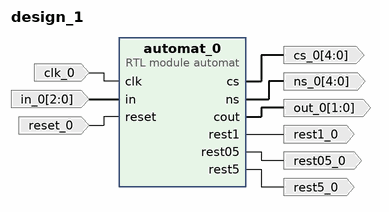
[diagram p0: block diagram of the top level]
# Vivado block design design_1, xc7a100tcsg324-1, Vivado 2020.2
create_bd_design design_1

create_bd_port -dir I -type clk clk_0
create_bd_port -dir O -from 4 -to 0 cs_0
create_bd_port -dir I -from 2 -to 0 in_0
create_bd_port -dir O -from 4 -to 0 ns_0
create_bd_port -dir O -from 1 -to 0 out_0
create_bd_port -dir I -type rst reset_0
create_bd_port -dir O rest05_0
create_bd_port -dir O rest1_0
create_bd_port -dir O rest5_0

create_bd_cell -type module -reference automat automat_0

# ---- connections ----

connect_bd_net -net clk_0_1 [get_bd_ports clk_0] [get_bd_pins automat_0/clk]
connect_bd_net [get_bd_pins automat_0/cs] [get_bd_ports cs_0]
connect_bd_net -net in_0_1 [get_bd_ports in_0] [get_bd_pins automat_0/in]
connect_bd_net [get_bd_pins automat_0/ns] [get_bd_ports ns_0]
connect_bd_net -net automat_0_out [get_bd_pins automat_0/cout] [get_bd_ports out_0]
connect_bd_net -net reset_0_1 [get_bd_ports reset_0] [get_bd_pins automat_0/reset]
connect_bd_net [get_bd_pins automat_0/rest05] [get_bd_ports rest05_0]
connect_bd_net [get_bd_pins automat_0/rest1] [get_bd_ports rest1_0]
connect_bd_net [get_bd_pins automat_0/rest5] [get_bd_ports rest5_0]

validate_bd_design
save_bd_design
